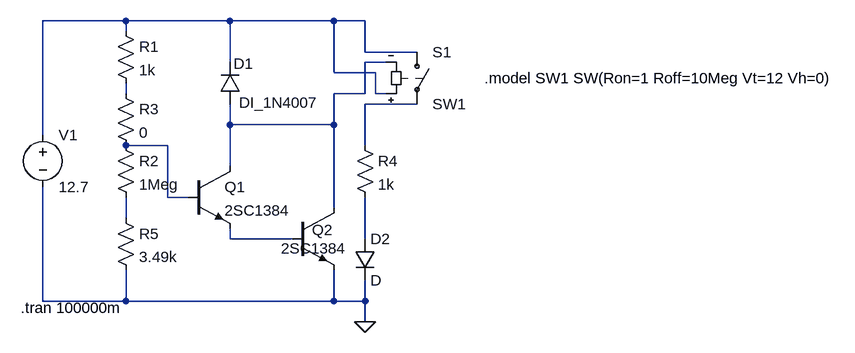
[diagram p0: schematic 達靈頓.asc]
達靈頓.asc, the LTspice schematic file:
Version 4
SHEET 1 1352 680
WIRE 192 -32 64 -32
WIRE 352 -32 192 -32
WIRE 512 -32 352 -32
WIRE 560 -32 512 -32
WIRE 192 -16 192 -32
WIRE 560 16 560 -32
WIRE 640 16 560 16
WIRE 352 32 352 -32
WIRE 592 32 560 32
WIRE 512 48 512 -32
WIRE 576 48 512 48
WIRE 192 80 192 64
WIRE 560 80 560 32
WIRE 560 80 512 80
WIRE 576 80 576 48
WIRE 592 80 576 80
WIRE 640 96 560 96
WIRE 352 128 352 96
WIRE 512 128 512 80
WIRE 512 128 352 128
WIRE 64 144 64 -32
WIRE 256 160 192 160
WIRE 560 160 560 96
WIRE 352 192 352 128
WIRE 256 240 256 160
WIRE 288 240 256 240
WIRE 512 256 512 128
WIRE 192 272 192 240
WIRE 352 304 352 288
WIRE 448 304 352 304
WIRE 560 304 560 240
WIRE 64 400 64 224
WIRE 192 400 192 352
WIRE 192 400 64 400
WIRE 512 400 512 352
WIRE 512 400 192 400
WIRE 560 400 560 368
WIRE 560 400 512 400
WIRE 560 432 560 400
FLAG 560 432 0
SYMBOL voltage 64 128 R0
WINDOW 123 0 0 Left 0
WINDOW 39 0 0 Left 0
SYMATTR InstName V1
SYMATTR Value 12.7
SYMBOL npn 448 256 R0
WINDOW 0 30 34 Left 2
WINDOW 3 -17 63 Left 2
SYMATTR InstName Q2
SYMATTR Value 2SC1384
SYMBOL res 544 144 R0
SYMATTR InstName R4
SYMATTR Value 1k
SYMBOL res 176 -32 R0
SYMATTR InstName R1
SYMATTR Value 1k
SYMBOL npn 288 192 R0
SYMATTR InstName Q1
SYMATTR Value 2SC1384
SYMBOL res 176 144 R0
SYMATTR InstName R2
SYMATTR Value 1Meg
SYMBOL res 176 64 R0
SYMATTR InstName R3
SYMATTR Value 0
SYMBOL res 176 256 R0
SYMATTR InstName R5
SYMATTR Value 3.49k
SYMBOL diode 368 96 R180
WINDOW 0 -20 62 Left 2
WINDOW 3 -120 2 Left 2
SYMATTR InstName D1
SYMATTR Value DI_1N4007
SYMBOL diode 544 304 R0
SYMATTR InstName D2
SYMBOL sw 640 0 R0
SYMATTR InstName S1
SYMATTR Value SW1
TEXT 30 410 Left 2 !.tran 100000m
TEXT 744 56 Left 2 !.model SW1 SW(Ron=1 Roff=10Meg Vt=12 Vh=0)

The netlist it stands for:
* 達靈頓.asc
V1 N001 0 12.7
Q2 N002 N007 0 0 2SC1384
R4 N004 N008 1k
R1 N001 N003 1k
Q1 N002 N005 N007 0 2SC1384
R2 N005 N006 1Meg
R3 N003 N005 0
R5 N006 0 3.49k
D1 N002 N001 DI_1N4007
D2 N008 0 D
S1 N001 N004 N001 N002 SW1
.model D D
.lib standard.dio
.model NPN NPN
.model PNP PNP
.lib standard.bjt
.tran 100000m
.model SW1 SW(Ron=1 Roff=10Meg Vt=12 Vh=0)
.backanno
.end